# EAGLE design e4 (EAGLE 8.2.1)
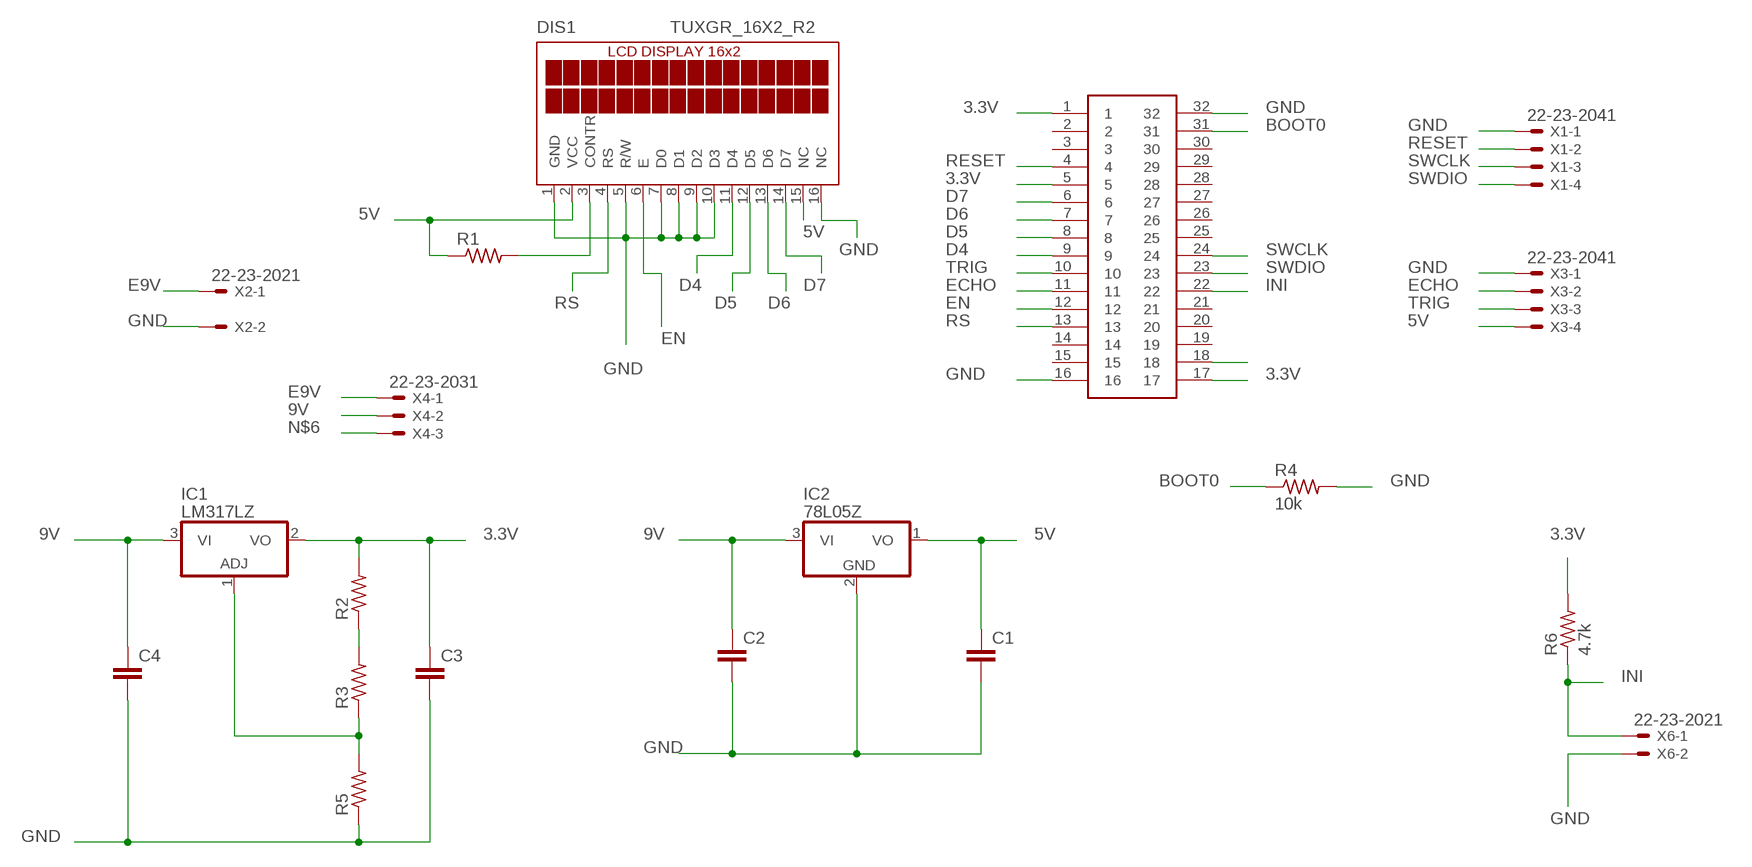
[diagram p0: schematic, sheet 1]

## Parts
C1  C2,5-3  [C2.5-3]
C2  C2,5-3  [C2.5-3]
C3  C2,5-3  [C2.5-3]
C4  C2,5-3  [C2.5-3]
DIS1  TUXGR_16X2_R2  [TUXGR_16X2_R2]
IC1  LM317LZ  [TO92]
IC2  78L05Z  [TO92]
R1  R-US_0207/5V  [0207/5V]
R2  R-US_0207/5V  [0207/5V]
R3  R-US_0207/5V  [0207/5V]
R4  10k  R-US_0207/5V  [0207/5V]
R5  R-US_0207/5V  [0207/5V]
R6  4.7k  R-US_0207/5V  [0207/5V]
U$1  MODULO_CORTEX_M0  [MODULO_CORTEX_M0]
X1  22-23-2041  [22-23-2041]
X2  22-23-2021  [22-23-2021]
X3  22-23-2041  [22-23-2041]
X4  22-23-2031  [22-23-2031]
X6  22-23-2021  [22-23-2021]

## Nets
3.3V: C3.1 IC1.2(VO) R2.2 R6.2 U$1.1 U$1.5 U$1.17
5V: C1.1 DIS1.2(VCC) DIS1.15(NC) IC2.1(VO) R1.1 X3.4
9V: C2.1 C4.1 IC1.3(VI) IC2.3(VI) X4.2
BOOT0: R4.1 U$1.31
D4: DIS1.11(D4) U$1.9
D5: DIS1.12(D5) U$1.8
D6: DIS1.13(D6) U$1.7
D7: DIS1.14(D7) U$1.6
E9V: X2.1 X4.1
ECHO: U$1.11 X3.2
EN: DIS1.6(E) U$1.12
GND: C1.2 C2.2 C3.2 C4.2 DIS1.1(GND) DIS1.5(R/W) DIS1.7(D0) DIS1.8(D1) DIS1.9(D2) DIS1.10(D3) DIS1.16(NC) IC2.2(GND) R4.2 R5.1 U$1.16 U$1.32 X1.1 X2.2 X3.1 X6.2
INI: R6.1 U$1.22 X6.1
N$1: R2.1 R3.2
N$2: U$1.18
N$5: DIS1.3(CONTR) R1.2
N$6: X4.3
N$7: IC1.1(ADJ) R3.1 R5.2
RESET: U$1.4 X1.2
RS: DIS1.4(RS) U$1.13
SWCLK: U$1.24 X1.3
SWDIO: U$1.23 X1.4
TRIG: U$1.10 X3.3
Unconnected: U$1.2 U$1.3 U$1.14 U$1.15 U$1.19 U$1.20 U$1.21 U$1.25 U$1.26 U$1.27 U$1.28 U$1.29 U$1.30

## Library data of the parts
C1-C4 = capacitor-wima:C: CAPACITOR naming: grid - package width
DIS1 = display-lcd:TUXGR_16X2_R2: Tuxgraphics LCD display 16x2 characters reflective, without background light Source: tuxgr_12x2_r2.pdf; OC_FARNELL: unknown; OC_NEWARK: unknown
IC1 = linear:*317: Positive VOLTAGE REGULATOR
IC2 = linear:78*: Positive VOLTAGE REGULATOR Source: http://cache.national.com/ds/LM/LM78L05.pdf http://www.fairchildsemi.com/ds/LM/LM7805.pdf
R1-R6 = adafruit:R-US_: RESISTOR, American symbol
U$1 = MODULO_CORTEX:MODULO_CORTEX_M0
X1 X3 = con-molex:22-23-2041: .100" (2.54mm) Center Header - 4 Pin; MF: MOLEX; MPN: 22-23-2041; OC_FARNELL: 1462920; OC_NEWARK: 38C0355
X2 X6 = con-molex:22-23-2021: .100" (2.54mm) Center Header - 2 Pin; MF: MOLEX; MPN: 22-23-2021; OC_FARNELL: 1462926; OC_NEWARK: 25C3832
X4 = con-molex:22-23-2031: .100" (2.54mm) Center Header - 3 Pin; MF: MOLEX; MPN: 22-23-2031; OC_FARNELL: 1462950; OC_NEWARK: 30C0862

## Board
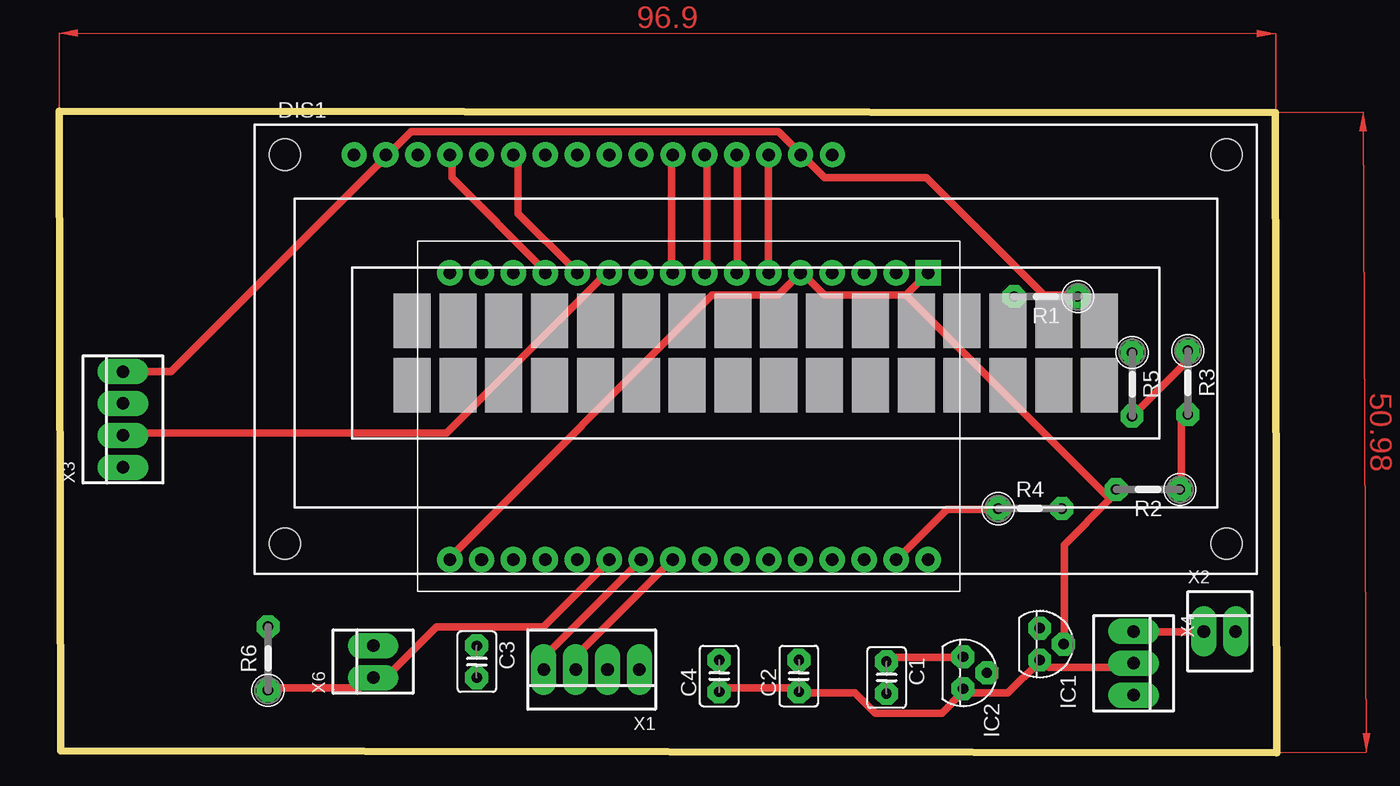
[diagram p1: board, top side]
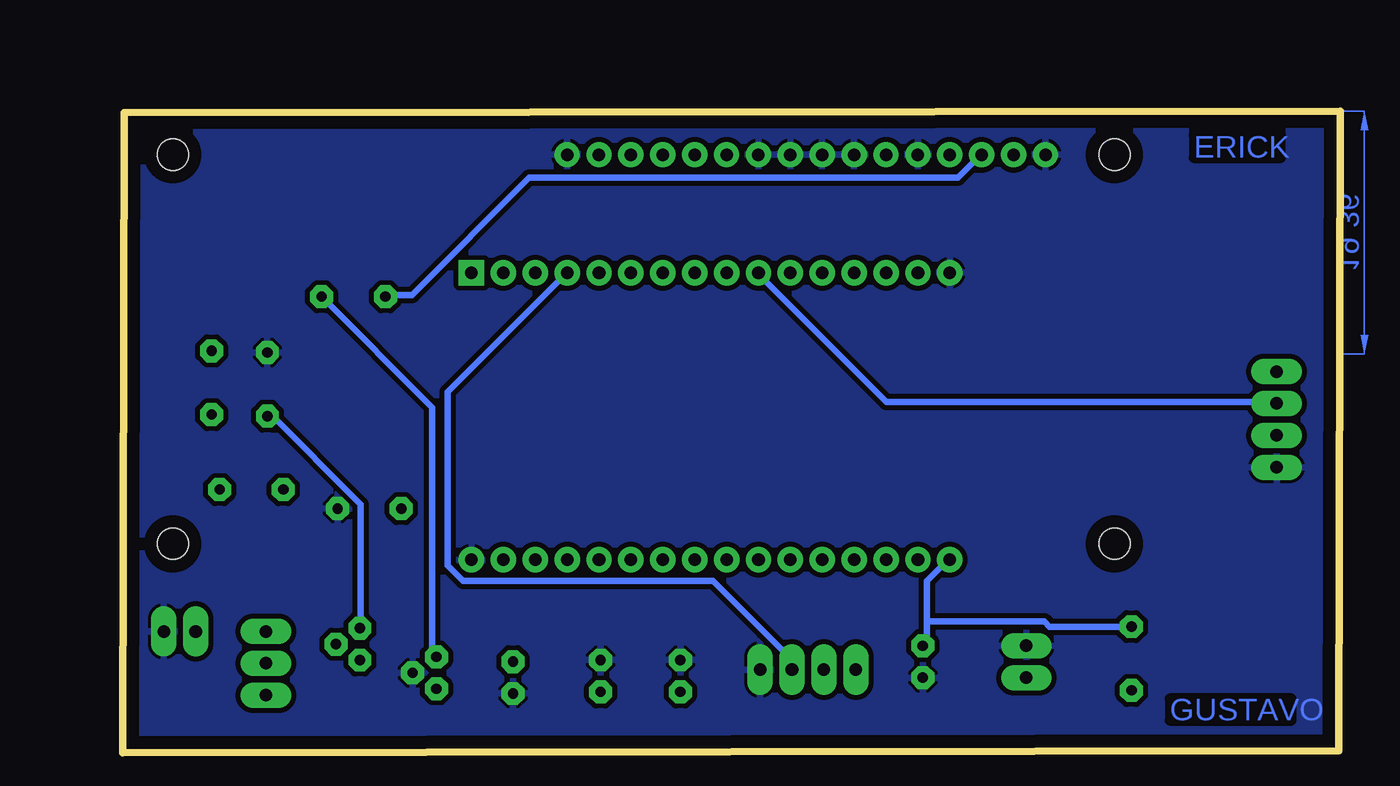
[diagram p2: board, bottom side, seen from below]

Size 97.01 x 51.1 mm. Coordinates in mm from the lower left corner, seen from the top.
Outline: 0.13,0.13 97.01,0 96.88,50.98 0,51.1 0.13,0.13
Copper layers (1*16): Top 0.035mm / dielectric 1.5mm / Bottom 0.035mm
Design rules "default *": minimum track width 16mil, minimum drill 0.35mm, track to track 16mil, track to pad 16mil, pad to pad 16mil, via to via 16mil, smd to smd 1mil, copper to edge 40mil, drill to drill 6mil, minimum pad ring 20mil, minimum via ring 8mil, stop-mask expansion 4mil, vias tented up to drill 0mil, thermal gap 10mil

### Footprints (pad centres in the part's own frame; a part is rotated, then mirrored left to right if it is on the bottom)
C2.5-3 = drill 0.813 pad 1.6 octagon: 1 -1.27,0; 2 1.27,0
TUXGR_16X2_R2 = drill 1 pad 1.676: 1 -32,15.5; 2 -29.46,15.5; 3 -26.92,15.5; 4 -24.38,15.5; 5 -21.84,15.5; 6 -19.3,15.5; 7 -16.76,15.5; 8 -14.22,15.5; 9 -11.68,15.5; 10 -9.14,15.5; 11 -6.6,15.5; 12 -4.06,15.5; 13 -1.52,15.5; 14 1.02,15.5; 15 3.56,15.5; 16 6.1,15.5 | hole 2.5: -37.5,-15.5; 37.5,-15.5; -37.5,15.5; 37.5,15.5
TO92 = drill 0.813 octagon: 1 -1.27,0; 2 0,1.905; 3 1.27,0
0207/5V = drill 0.813 pad 1.676 octagon: 1 -2.54,0; 2 2.54,0
MODULO_CORTEX_M0 = drill 1 pad 1.93 square: 1 -22.86,-2.54 | drill 1 pad 1.93: 2 -22.86,-5.08; 3 -22.86,-7.62; 4 -22.86,-10.16; 5 -22.86,-12.7; 6 -22.86,-15.24; 7 -22.86,-17.78; 8 -22.86,-20.32; 9 -22.86,-22.86; 10 -22.86,-25.4; 11 -22.86,-27.94; 12 -22.86,-30.48; 13 -22.86,-33.02; 14 -22.86,-35.56; 15 -22.86,-38.1; 16 -22.86,-40.64; 17 0,-40.64; 18 0,-38.1; 19 0,-35.56; 20 0,-33.02; 21 0,-30.48; 22 0,-27.94; 23 0,-25.4; 24 0,-22.86; 25 0,-20.32; 26 0,-17.78; 27 0,-15.24; 28 0,-12.7; 29 0,-10.16; 30 0,-7.62; 31 0,-5.08; 32 0,-2.54
22-23-2041 = drill 1 long: 1 -3.81,0; 2 -1.27,0; 3 1.27,0; 4 3.81,0
22-23-2021 = drill 1 long: 1 -1.27,0; 2 1.27,0
22-23-2031 = drill 1 long: 1 -2.54,0; 2 0,0; 3 2.54,0

### Placement (x,y rotation side)
C1  65.91,5.97 270 top
C2  58.93,6.1 90 top
C3  33.27,7.24 270 top
C4  52.58,6.1 90 top
DIS1  55.5,32.13 0 top
IC1  78.11,8.64 270 top
IC2  72.01,6.35 270 top
R1  78.61,36.32 180 top
R2  86.74,20.95 180 top
R3  89.92,29.46 270 top
R4  77.34,19.43 0 top
R5  85.47,29.34 270 top
R6  16.64,7.49 90 top
U$1  71.75,15.37 270 top
X1  42.42,6.6 180 top
X2  92.46,9.65 0 top
X3  5.08,26.54 90 top
X4  85.6,7.11 270 top
X6  25.02,7.24 90 top

### Tracks (layer width: path | path; a pad name or v marks a point on that pad's centre or on a via)
3.3V
  Top 0.61: 67.46,36.45 60.96,36.45 59.33,38.07 U$1.5 58.93,38.07 57.3,36.45 52.02,36.45 31.29,15.72 U$1.17 | 67.46,36.45 69.09,38.07 U$1.1 | 83.72,20.19 84.12,20.6 R2.2 83.72,20.19 | 83.72,20.19 80.06,16.54 80.06,8.81 IC1.2 | 83.72,20.19 67.46,36.45
  Bottom 0.508: 32.92,10.44 32.92,13.69 31.29,15.32 U$1.17 | 32.92,10.44 32.92,8.81 C3.1 | R6.2 23.16,10.03 23.57,10.44 32.92,10.44
5V
  Top 0.61: X3.4 8.94,30.35 26.01,47.42 DIS1.2 26.42,47.83 28.04,49.45 57.3,49.45 58.93,47.83 DIS1.15 59.33,47.42 60.96,45.8 69.09,45.8 78.44,36.45 80.87,36.45 R1.1 | C1.1 66.24,7.59 71.93,7.59 IC2.1
  Bottom 0.508: R1.1 72.34,27.51 72.34,8 IC2.1
9V
  Top 0.61: C4.1 52.83,5.16 58.93,5.16 C2.1 58.93,4.75 63.4,4.75 65.02,3.12 70.31,3.12 71.93,4.75 IC2.3 72.34,4.75 75.59,4.75 78.03,7.19 IC1.3 78.44,7.19 78.84,6.78 85.34,6.78 X4.2
BOOT0
  Top 0.61: R4.1 74.78,19.38 70.71,19.38 67.06,15.72 U$1.31
D4
  Top 0.61: U$1.9 48.77,38.48 48.77,47.42 DIS1.11
D5
  Top 0.61: U$1.8 51.61,38.48 51.61,47.42 DIS1.12
D6
  Top 0.61: U$1.7 54.05,38.48 54.05,47.42 DIS1.13
D7
  Top 0.61: U$1.6 56.49,38.48 56.49,47.42 DIS1.14
E9V
  Top 0.61: X4.1 85.75,9.63 91.03,9.63 X2.1
ECHO
  Top 0.61: X3.2 5.28,25.48 30.89,25.48 43.48,38.07 U$1.11
EN
  Top 0.61: DIS1.6 36.58,47.42 36.58,42.95 41.05,38.48 U$1.12
GND
  pour Bottom: 0,51.05 0,0 97.03,0 97.03,51.05
INI
  Top 0.61: R6.1 16.66,5.16 23.98,5.16 24.79,5.97 X6.1 26.01,5.97 30.07,10.03 38.61,10.03 43.48,14.91 43.48,15.32 U$1.22
N$1
  Top 0.61: R2.1 89.41,21.01 89.41,26.29 89.81,26.7 R3.2
N$5
  Bottom 0.508: R1.2 76,36.45 73.97,36.45 64.62,45.8 30.48,45.8 28.85,47.42 DIS1.3
N$7
  Top 0.61: R3.1 89.81,31.98 89.81,31.17 85.75,27.1 R5.2
  Bottom 0.508: IC1.1 78.03,10.03 78.03,19.79 85.34,27.1 R5.2
RESET
  Bottom 0.508: X1.2 43.89,6.78 43.89,7.59 49.99,13.69 69.9,13.69 71.12,14.91 71.12,28.73 61.77,38.07 U$1.4
RS
  Top 0.61: DIS1.4 31.29,47.42 31.29,45.8 38.61,38.48 U$1.13
SWCLK
  Top 0.61: X1.3 41.45,6.78 41.45,8 48.77,15.32 U$1.24
SWDIO
  Top 0.61: X1.4 38.61,7.59 46.33,15.32 U$1.23
TRIG
  Bottom 0.508: X3.3 5.28,27.91 36.17,27.91 46.33,38.07 U$1.10
(copper drawn outside any net)
  shapes: Bottom area x1, Top area x2

### Text on the board
Bottom: ERICK | GUSTAVO